# Altium schematic sheet cs301_YourGroupNumber---------------.SchDoc
size A4; SheetNumber: 1; SheetTotal: 1
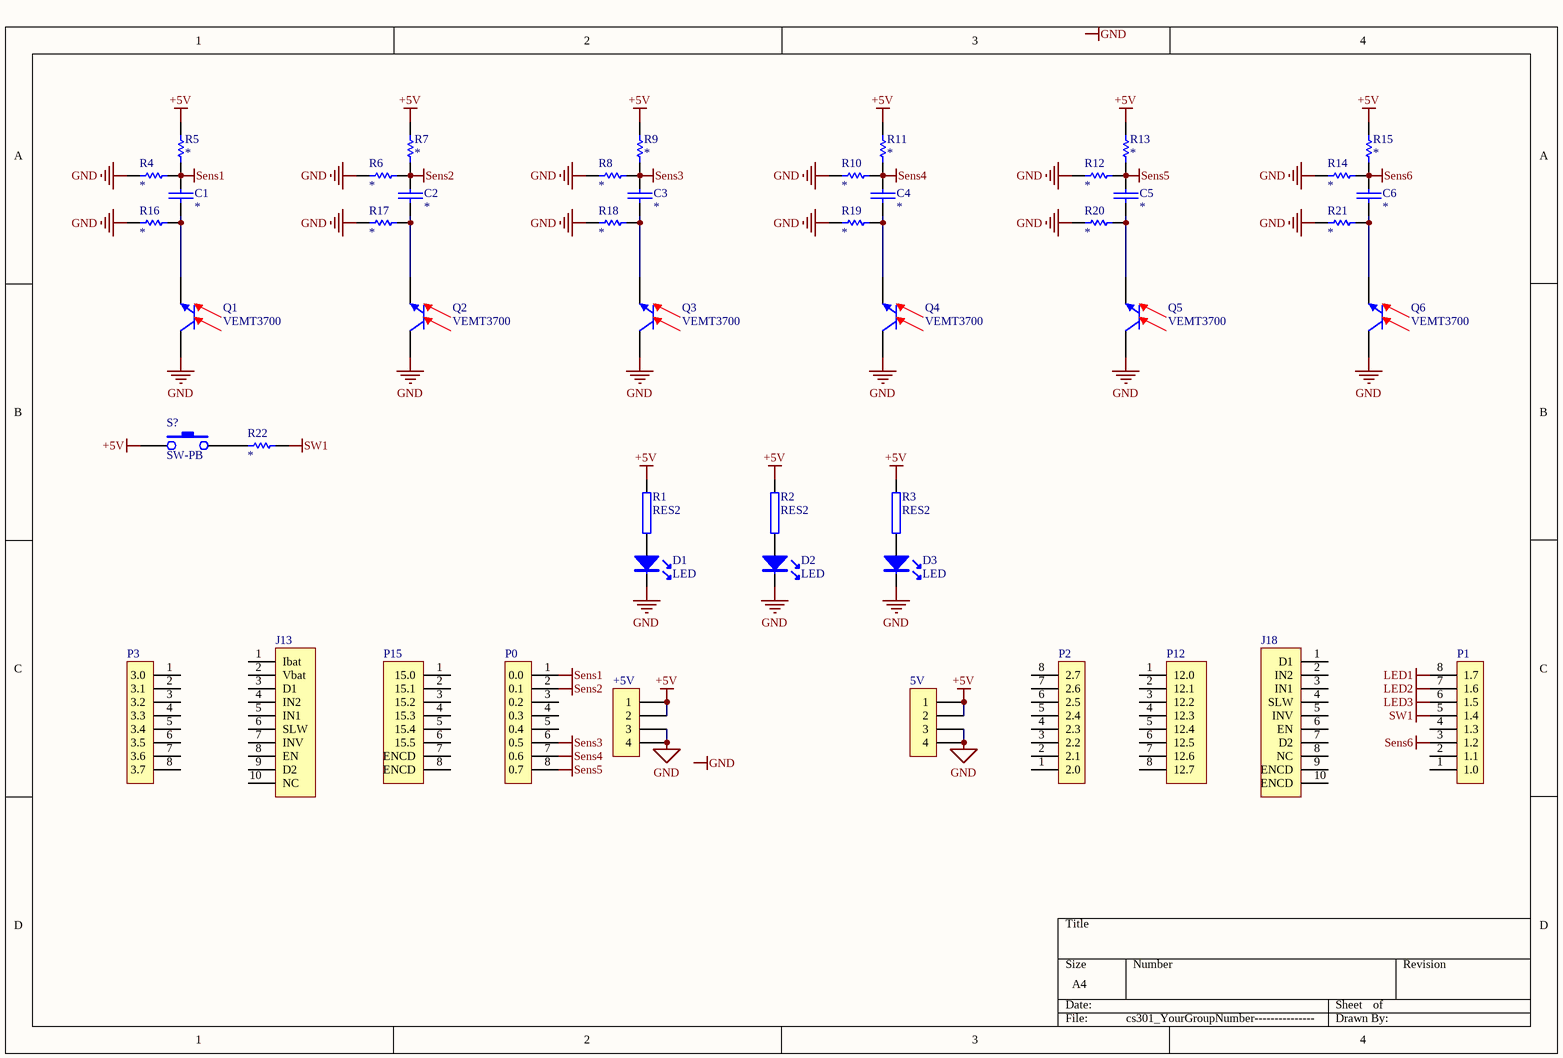
[diagram p0: cs301_YourGroupNumber---------------.SchDoc]

## Parts
5V  5V  [IDC4]  (value not drawn)
+5V  5V  [IDC4]  (value not drawn)
C1  *  [ece-RAD0.2]
C2  *  [ece-RAD0.2]
C3  *  [ece-RAD0.2]
C4  *  [ece-RAD0.2]
C5  *  [ece-RAD0.2]
C6  *  [ece-RAD0.2]
D1  LED  [LED0.1/5MM]
D2  LED  [LED0.1/5MM]
D3  LED  [LED0.1/5MM]
J13  CON10  [idc10]  (value not drawn)
J18  CON10  [IDC10]  (value not drawn)
P0  P0  [idc8]  (value not drawn)
P1  P1  [idc8]  (value not drawn)
P2  P2  [idc8]  (value not drawn)
P3  P3  [idc8]  (value not drawn)
P12  P12  [idc8]  (value not drawn)
P15  P15  [idc8]  (value not drawn)
Q1  VEMT3700  [VEMT3700]
Q2  VEMT3700  [VEMT3700]
Q3  VEMT3700  [VEMT3700]
Q4  VEMT3700  [VEMT3700]
Q5  VEMT3700  [VEMT3700]
Q6  VEMT3700  [VEMT3700]
R1  RES2  [AXIAL0.4]
R2  RES2  [AXIAL0.4]
R3  RES2  [AXIAL0.4]
R4  *  [ece-AXIAL0.4]
R5  *  [ece-AXIAL0.4]
R6  *  [ece-AXIAL0.4]
R7  *  [ece-AXIAL0.4]
R8  *  [ece-AXIAL0.4]
R9  *  [ece-AXIAL0.4]
R10  *  [ece-AXIAL0.4]
R11  *  [ece-AXIAL0.4]
R12  *  [ece-AXIAL0.4]
R13  *  [ece-AXIAL0.4]
R14  *  [ece-AXIAL0.4]
R15  *  [ece-AXIAL0.4]
R16  *  [ece-AXIAL0.4]
R17  *  [ece-AXIAL0.4]
R18  *  [ece-AXIAL0.4]
R19  *  [ece-AXIAL0.4]
R20  *  [ece-AXIAL0.4]
R21  *  [ece-AXIAL0.4]
R22  *  [ece-AXIAL0.4]
S?  SW-PB  [SW-PB]

## Nets
+5V: 5V.1 5V.2 +5V.1 +5V.2 R1.2 R2.2 R3.1 R5.2 R7.2 R9.2 R11.2 R13.2 R15.2 S?.1
GND: 5V.3 5V.4 +5V.3 +5V.4 D1.K D2.K D3.K Q1.1(C) Q2.1(C) Q3.1(C) Q4.1(C) Q5.1(C) Q6.1(C) R4.1 R6.2 R8.2 R10.2 R12.2 R14.2 R16.1 R17.1 R18.1 R19.1 R20.1 R21.1
LED1: P1.8(1.7)
LED2: P1.7(1.6)
LED3: P1.6(1.5)
Sens1: C1.1 P0.1(0.0) R4.2 R5.1
Sens2: C2.1 P0.2(0.1) R6.1 R7.1
Sens3: C3.1 P0.6(0.5) R8.1 R9.1
Sens4: C4.1 P0.7(0.6) R10.1 R11.1
Sens5: C5.1 P0.8(0.7) R12.1 R13.1
Sens6: C6.1 P1.3(1.2) R14.1 R15.1
SW1: P1.5(1.4) R22.2
NetC1_2: C1.2 Q1.2(E) R16.2
NetC2_2: C2.2 Q2.2(E) R17.2
NetC3_2: C3.2 Q3.2(E) R18.2
NetC4_2: C4.2 Q4.2(E) R19.2
NetC5_2: C5.2 Q5.2(E) R20.2
NetC6_2: C6.2 Q6.2(E) R21.2
NetD1_A: D1.A R1.1
NetD2_A: D2.A R2.1
NetD3_A: D3.A R3.2
NetR22_1: R22.1 S?.2

Not connected (* = marked no-connect by the designer): J13 1(Ibat) 2(Vbat) 3(D1) 4(IN2) 5(IN1) 6(SLW) 7(INV) 8(EN) 9(D2) 10(NC); J18 1(D1) 2(IN2) 3(IN1) 4(SLW) 5(INV) 6(EN) 7(D2) 8(NC) 9(ENCD) 10(ENCD); P0 3(0.2) 4(0.3) 5(0.4); P1 1(1.0) 2(1.1) 4(1.3); P2 1(2.0) 2(2.1) 3(2.2) 4(2.3) 5(2.4) 6(2.5) 7(2.6) 8(2.7); P3 1(3.0) 2(3.1) 3(3.2) 4(3.3) 5(3.4) 6(3.5) 7(3.6) 8(3.7); P12 1(12.0) 2(12.1) 3(12.2) 4(12.3) 5(12.4) 6(12.5) 7(12.6) 8(12.7); P15 1(15.0) 2(15.1) 3(15.2) 4(15.3) 5(15.4) 6(15.5) 7(ENCD) 8(ENCD)

## Notes on the sheet
- Labels drawn without touching a wire or pin: GND

## Library data of the parts
5V +5V = CON4: Connector
C1-C6 = CAP: Capacitor Non Polarised Through Hole; Value: *
J13 J18 = CON10: Connector
P0-P3 = CON8: Connector
P12 P15 = CON8_1: Connector
Q1-Q6 = VEMT3700: Silicon NPN Phototransistor
R4-R22 = Res1: Resistor; Published: 8-Jun-2000; LatestRevisionDate: 17-Jul-2002; LatestRevisionNote: Re-released for DXP Platform.; PackageReference: AXIAL-0.3; Publisher: Altium Limited; Value: *
S? = SW-PB: Push Button Switch